# Altium schematic sheet GPS_Adapter.SchDoc
size A
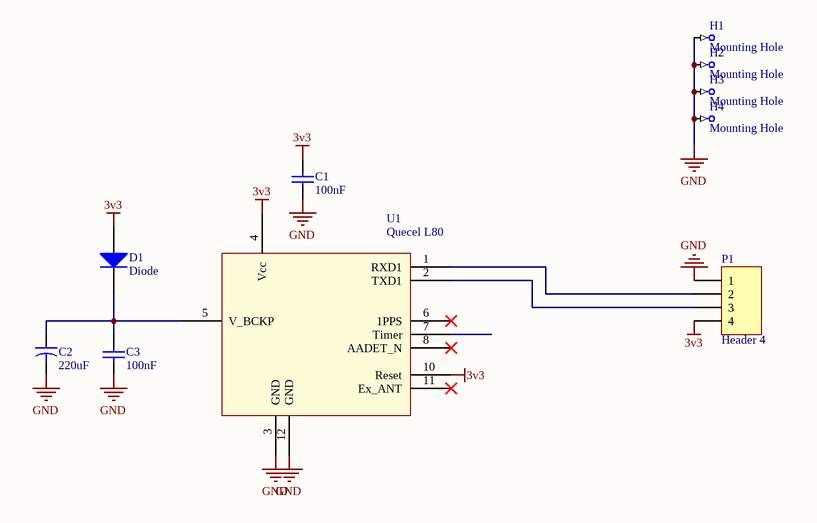
[diagram p0: GPS_Adapter.SchDoc]

## Parts
C1  100nF  [R0805]
C2  220uF  [SMD CAPACITOR 220UF 16V]
C3  100nF  [R0805]
D1  Diode  [Diode]
H1  Mounting Hole  [M3 BOLT HOLE]  (no BOM)
H2  Mounting Hole  [M3 BOLT HOLE]  (no BOM)
H3  Mounting Hole  [M3 BOLT HOLE]  (no BOM)
H4  Mounting Hole  [M3 BOLT HOLE]  (no BOM)
P1  Header 4  [SMD 4Wire]
U1  Quecel L80  [Quectel L80 GPS]

## Nets
3v3: C1.2 D1.1(A) P1.4 U1.4(Vcc) U1.10(Reset)
GND: C1.1 C2.2 C3.1 H1.1 H2.1 H3.1 H4.1 P1.1 U1.3(GND) U1.12(GND)
NetC2_1: C2.1 C3.2 D1.2(K) U1.5(V_BCKP)
NetP1_2: P1.2 U1.1(RXD1)
NetP1_3: P1.3 U1.2(TXD1)

Not connected (* = marked no-connect by the designer): U1 6(1PPS)* 7(Timer) 8(AADET_N)* 11(Ex_ANT)*

## Library data of the parts
C1 C3 = Cap: Capacitor; Value: 100pF; Published: 8-Jun-2000; LatestRevisionDate: 17-Jul-2002; LatestRevisionNote: Re-released for DXP Platform.; PackageReference: RAD-0.3; Publisher: Altium Limited; PackageDescription: Radial Cap, Thru-Hole; 2 Leads; 0.3 in Pin Spacing
C2 = Cap2: Capacitor; Value: 100pF; Published: 23-Sep-2002; PackageReference: CAPR5-4X5; Publisher: Altium Limited; PackageDescription: Capacitor; 2 Leads
D1 = Diode: Default Diode; Published: 8-Jun-2000; LatestRevisionDate: 17-Jul-2002; LatestRevisionNote: Re-released for DXP Platform.; PackageVersion: Sep-1996; PackageReference: SMC; Publisher: Altium Limited; PackageDescription: DO-214-AB/SMC; 2 C-Bend Leads; Body 7.9 x 5.9 mm, inc. leads (LxW); Code_JEDEC: DO-214-AB
H1-H4 = TestPin
P1 = Header 4: Header, 4-Pin; LatestRevisionDate: 17-Jul-2002; LatestRevisionNote: Re-released for DXP Platform.; Publisher: Altium Limited